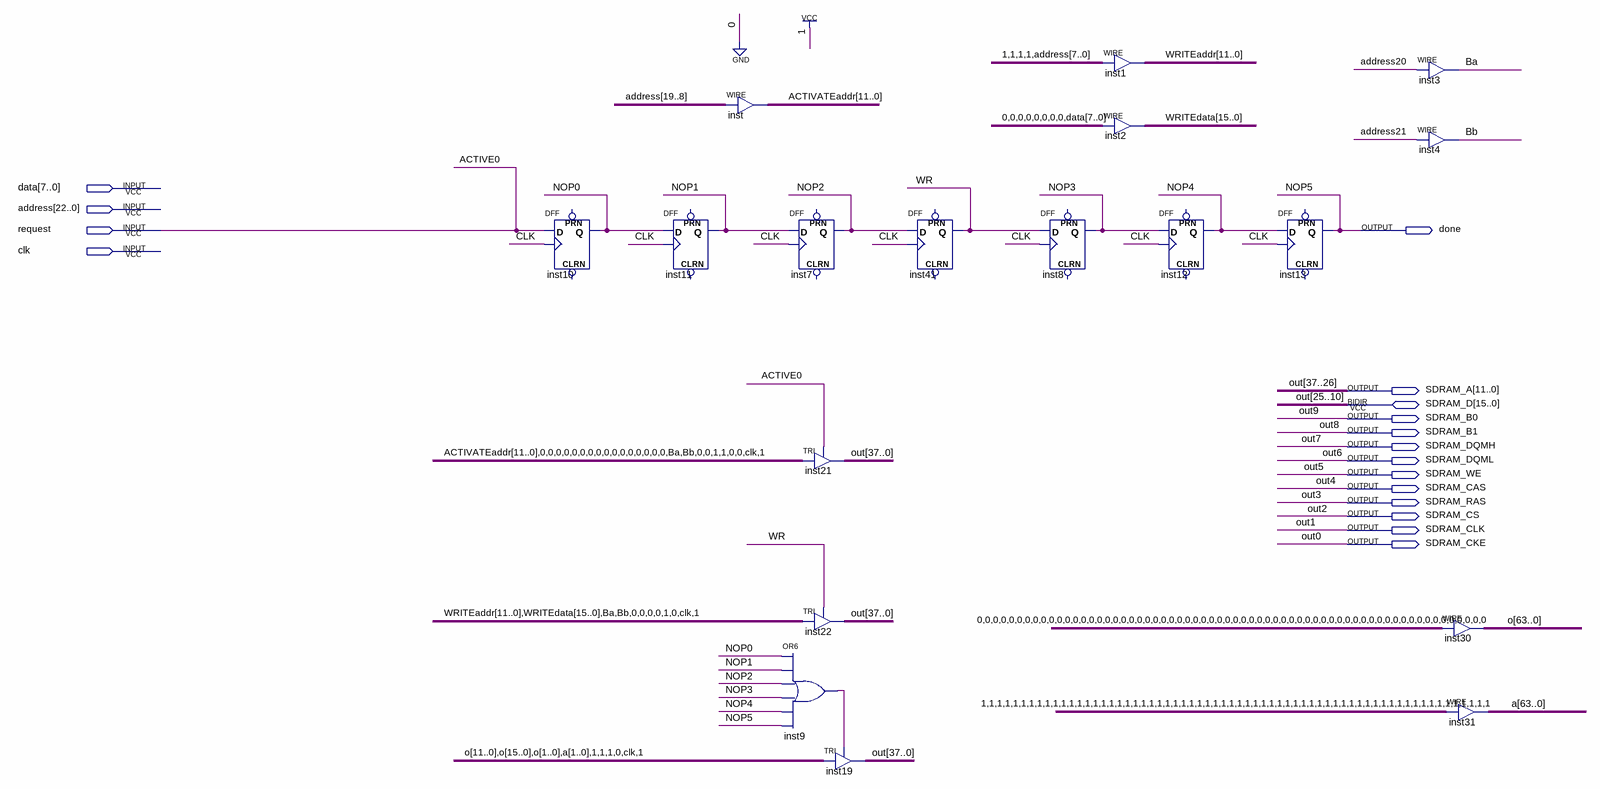
[diagram p0: schematic sheet]
// Quartus schematic WriteSDRAM.bdf as structural Verilog: 18 symbols, 17 pins
module WriteSDRAM (
  input  [7:0] data,
  input  [22:0] address,
  input  request,
  input  clk,
  inout  [15:0] SDRAM_D,
  output done,
  output [11:0] SDRAM_A,
  output SDRAM_B0,
  output SDRAM_B1,
  output SDRAM_DQMH,
  output SDRAM_DQML,
  output SDRAM_WE,
  output SDRAM_CAS,
  output SDRAM_RAS,
  output SDRAM_CS,
  output SDRAM_CLK,
  output SDRAM_CKE
);

  wire Ba, Bb, inst9_out, NOP0, NOP1, NOP2, NOP3, NOP4, WR;
  wire [11:0] ACTIVATEaddr, WRITEaddr;
  wire [15:0] WRITEdata;
  wire [63:0] a, o;

  DFF inst10 (.CLK(clk), .D(request), .Q(NOP0));  // open: CLRN, PRN
  DFF inst11 (.CLK(clk), .D(NOP0), .Q(NOP1));  // open: CLRN, PRN
  assign ACTIVATEaddr = address[19:8];  // WIRE inst
  DFF inst7 (.CLK(clk), .D(NOP1), .Q(NOP2));  // open: CLRN, PRN
  TRI inst21[37:0] (
    .IN({ACTIVATEaddr, {16{1'b0}}, Ba, Bb, 6'b001100, clk, 1'b1}), .OE(request),
    .OUT({SDRAM_A, SDRAM_D, SDRAM_B0, SDRAM_B1, SDRAM_DQMH, SDRAM_DQML, SDRAM_WE, SDRAM_CAS, SDRAM_RAS, SDRAM_CS, SDRAM_CLK, SDRAM_CKE}));
  TRI inst22[37:0] (
    .IN({WRITEaddr, WRITEdata, Ba, Bb, 6'b000010, clk, 1'b1}), .OE(WR),
    .OUT({SDRAM_A, SDRAM_D, SDRAM_B0, SDRAM_B1, SDRAM_DQMH, SDRAM_DQML, SDRAM_WE, SDRAM_CAS, SDRAM_RAS, SDRAM_CS, SDRAM_CLK, SDRAM_CKE}));
  or inst9 (inst9_out, NOP0, NOP1, NOP2, NOP3, NOP4, done);
  TRI inst19[37:0] (
    .IN({o[11:0], o[15:0], o[1:0], a[1:0], 4'b1110, clk, 1'b1}), .OE(inst9_out),
    .OUT({SDRAM_A, SDRAM_D, SDRAM_B0, SDRAM_B1, SDRAM_DQMH, SDRAM_DQML, SDRAM_WE, SDRAM_CAS, SDRAM_RAS, SDRAM_CS, SDRAM_CLK, SDRAM_CKE}));
  DFF inst41 (.CLK(clk), .D(NOP2), .Q(WR));  // open: CLRN, PRN
  DFF inst8 (.CLK(clk), .D(WR), .Q(NOP3));  // open: CLRN, PRN
  assign WRITEaddr = {4'b1111, address[7:0]};  // WIRE inst1
  assign WRITEdata = {{8{1'b0}}, data};  // WIRE inst2
  DFF inst12 (.CLK(clk), .D(NOP3), .Q(NOP4));  // open: CLRN, PRN
  DFF inst13 (.CLK(clk), .D(NOP4), .Q(done));  // open: CLRN, PRN
  assign Ba = address[20];  // WIRE inst3
  assign Bb = address[21];  // WIRE inst4
  assign o = {64{1'b0}};  // WIRE inst30
  assign a = {64{1'b1}};  // WIRE inst31

  // Other names for the same wires on the sheet: NOP5 = done;
  //   out[37:0] = {SDRAM_A, SDRAM_D, SDRAM_B0, SDRAM_B1, SDRAM_DQMH, SDRAM_DQML, SDRAM_WE, SDRAM_CAS, SDRAM_RAS, SDRAM_CS, SDRAM_CLK, SDRAM_CKE};
  //   out0 = SDRAM_CKE; out1 = SDRAM_CLK; out2 = SDRAM_CS; out3 = SDRAM_RAS; out4 = SDRAM_CAS; out5 = SDRAM_WE;
  //   out6 = SDRAM_DQML; out7 = SDRAM_DQMH; out8 = SDRAM_B1; out9 = SDRAM_B0; ACTIVE0 = request
endmodule
